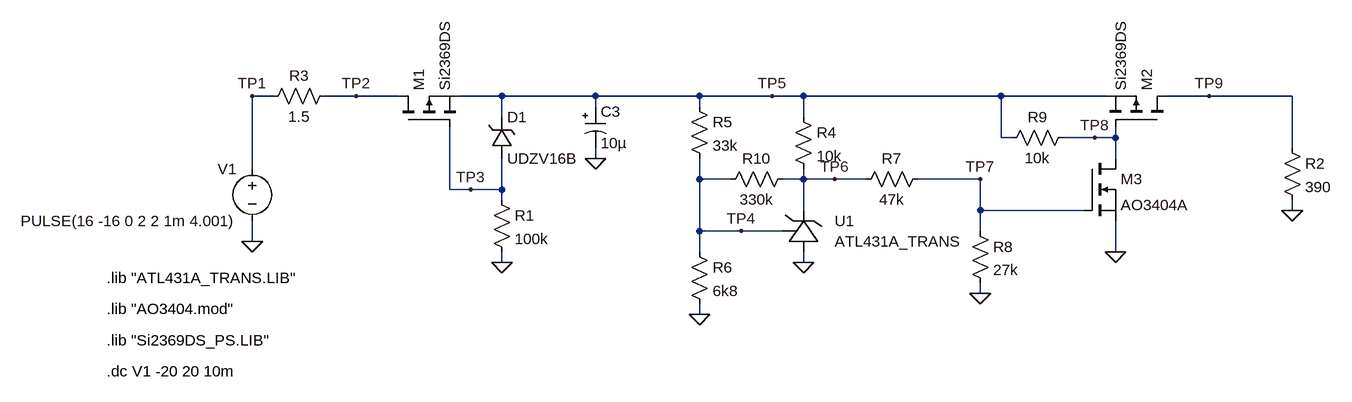
[diagram p0: schematic TBP_Protection_Sim.asc]
TBP_Protection_Sim.asc, the LTspice schematic file:
Version 4
SHEET 1 2592 680
WIRE -192 -64 -224 -64
WIRE -64 -64 -112 -64
WIRE 0 -64 -64 -64
WIRE 160 -64 96 -64
WIRE 304 -64 160 -64
WIRE 464 -64 304 -64
WIRE 576 -64 464 -64
WIRE 624 -64 576 -64
WIRE 928 -64 624 -64
WIRE 1088 -64 928 -64
WIRE 1248 -64 1184 -64
WIRE 1376 -64 1248 -64
WIRE 304 -48 304 -64
WIRE 464 -48 464 -64
WIRE 160 -32 160 -64
WIRE 624 -32 624 -64
WIRE 928 0 928 -64
WIRE 944 0 928 0
WIRE 1072 0 1024 0
WIRE 1104 0 1104 -16
WIRE 1104 0 1072 0
WIRE 1376 16 1376 -64
WIRE 304 32 304 16
WIRE 1104 32 1104 0
WIRE -224 48 -224 -64
WIRE 464 64 464 32
WIRE 512 64 464 64
WIRE 624 64 624 48
WIRE 624 64 592 64
WIRE 672 64 624 64
WIRE 720 64 672 64
WIRE 896 64 800 64
WIRE 80 80 80 -16
WIRE 112 80 80 80
WIRE 160 80 160 32
WIRE 160 80 112 80
WIRE 160 96 160 80
WIRE 624 112 624 64
WIRE 896 112 896 64
WIRE 1056 112 896 112
WIRE 1376 112 1376 96
WIRE 464 144 464 64
WIRE 528 144 464 144
WIRE 592 144 528 144
WIRE 896 144 896 112
WIRE -224 160 -224 128
WIRE 464 176 464 144
WIRE 1104 176 1104 128
WIRE 160 192 160 176
WIRE 624 192 624 176
WIRE 896 240 896 224
WIRE 464 272 464 256
FLAG -224 160 0
FLAG 160 192 0
FLAG 1376 112 0
FLAG 464 272 0
FLAG 1104 176 0
FLAG 896 240 0
FLAG 304 32 0
FLAG 624 192 0
FLAG -224 -64 TP1
FLAG -64 -64 TP2
FLAG 112 80 TP3
FLAG 528 144 TP4
FLAG 576 -64 TP5
FLAG 672 64 TP6
FLAG 896 64 TP7
FLAG 1072 0 TP8
FLAG 1248 -64 TP9
SYMBOL voltage -224 32 M0
WINDOW 123 0 0 Left 0
WINDOW 39 0 0 Left 0
SYMATTR InstName V1
SYMATTR Value PULSE(16 -16 0 2 2 1m 4.001)
SYMBOL zener 144 32 M180
WINDOW 0 24 64 Left 2
WINDOW 3 24 0 Left 2
SYMATTR InstName D1
SYMATTR Value UDZV16B
SYMATTR Description Diode
SYMATTR Type diode
SYMBOL res 144 80 R0
SYMATTR InstName R1
SYMATTR Value 100k
SYMBOL res 1360 0 R0
SYMATTR InstName R2
SYMATTR Value 390
SYMBOL res 608 -48 R0
SYMATTR InstName R4
SYMATTR Value 10k
SYMBOL res -96 -80 R90
WINDOW 0 0 56 VBottom 2
WINDOW 3 32 56 VTop 2
SYMATTR InstName R3
SYMATTR Value 1.5
SYMBOL res 448 -64 R0
SYMATTR InstName R5
SYMATTR Value 33k
SYMBOL res 448 160 R0
SYMATTR InstName R6
SYMATTR Value 6k8
SYMBOL nmos 1056 32 R0
SYMATTR InstName M3
SYMATTR Value AO3404A
SYMATTR Prefix X
SYMBOL res 816 48 R90
WINDOW 0 0 56 VBottom 2
WINDOW 3 32 56 VTop 2
SYMATTR InstName R7
SYMATTR Value 47k
SYMBOL res 880 128 R0
SYMATTR InstName R8
SYMATTR Value 27k
SYMBOL res 1040 -16 R90
WINDOW 0 0 56 VBottom 2
WINDOW 3 32 56 VTop 2
SYMATTR InstName R9
SYMATTR Value 10k
SYMBOL AutoGenerated\\ATL431A_TRANS 624 160 M0
SYMATTR InstName U1
SYMBOL res 608 48 R90
WINDOW 0 0 56 VBottom 2
WINDOW 3 32 56 VTop 2
SYMATTR InstName R10
SYMATTR Value 330k
SYMBOL polcap 288 -48 R0
WINDOW 3 24 56 Left 2
SYMATTR InstName C3
SYMATTR Value 10µ
SYMATTR Description Capacitor
SYMATTR Type cap
SYMATTR SpiceLine V=25 Irms=1.12694 Rser=0.1 Lser=0 mfg="KEMET" pn="T521B106M025ATE100" type="Tantalum"
SYMBOL pmos 1184 -16 M270
SYMATTR InstName M2
SYMATTR Value Si2369DS
SYMATTR Prefix X
SYMBOL pmos 0 -16 R270
SYMATTR InstName M1
SYMATTR Value Si2369DS
SYMATTR Prefix X
TEXT -448 360 Left 2 !.dc V1 -20 20 10m
TEXT -448 312 Left 2 !.lib "Si2369DS_PS.LIB"
TEXT -448 264 Left 2 !.lib "AO3404.mod"
TEXT -448 216 Left 2 !.lib "ATL431A_TRANS.LIB"

The netlist it stands for:
* TBP_Protection_Sim.asc
V1 TP1 0 PULSE(16 -16 0 2 2 1m 4.001)
D1 TP3 TP5 UDZV16B
R1 TP3 0 100k
R2 TP9 0 390
R4 TP5 TP6 10k
R3 TP2 TP1 1.5
R5 TP5 TP4 33k
R6 TP4 0 6k8
XM3 TP8 TP7 0 AO3404A  ; pins D G S
R7 TP7 TP6 47k
R8 TP7 0 27k
R9 TP8 TP5 10k
XU1 TP6 TP4 0 ATL431A_TRANS  ; pins CATHODE REF ANODE
R10 TP6 TP4 330k
C3 TP5 0 10µ V=25 Irms=1.12694 Rser=0.1 Lser=0 mfg="KEMET" pn="T521B106M025ATE100" type="Tantalum"
XM2 TP9 TP8 TP5 Si2369DS  ; pins D G S
XM1 TP2 TP3 TP5 Si2369DS  ; pins D G S
.model D D
.lib standard.dio
.dc V1 -20 20 10m
.lib "Si2369DS_PS.LIB"
.lib "AO3404.mod"
.lib "ATL431A_TRANS.LIB"
.lib C:\users\ehaag\Documents\LTspiceXVII\SPICE_Models\ATL431A_PSPICE_TRANS\ATL431A_TRANS.LIB
.backanno
.end